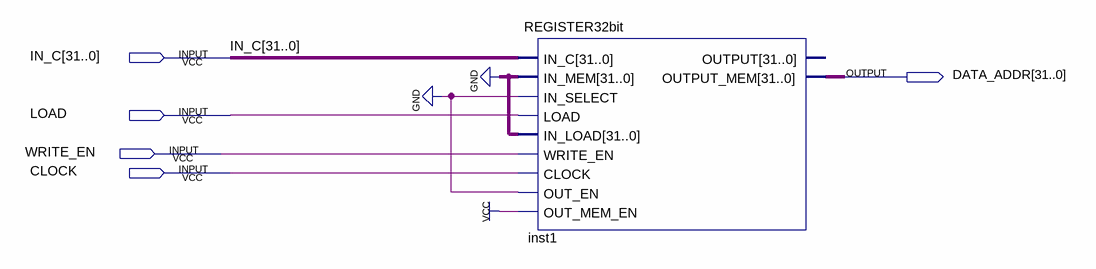
[diagram p0: schematic sheet]
// Quartus schematic MAR.bdf as structural Verilog: 1 symbols, 5 pins
module MAR (
  input  [31:0] IN_C,
  input  LOAD,
  input  WRITE_EN,
  input  CLOCK,
  output [31:0] DATA_ADDR
);

  REGISTER32bit inst1 (
    .IN_C(IN_C), .IN_MEM({32{1'b0}}), .IN_SELECT(1'b0), .LOAD(LOAD), .IN_LOAD({32{1'b0}}),
    .WRITE_EN(WRITE_EN), .CLOCK(CLOCK), .OUT_EN(1'b0), .OUT_MEM_EN(1'b1), .OUTPUT_MEM(DATA_ADDR));  // open: OUTPUT
endmodule
